# EAGLE design RHD2132_headstage_16 (EAGLE 6.2)
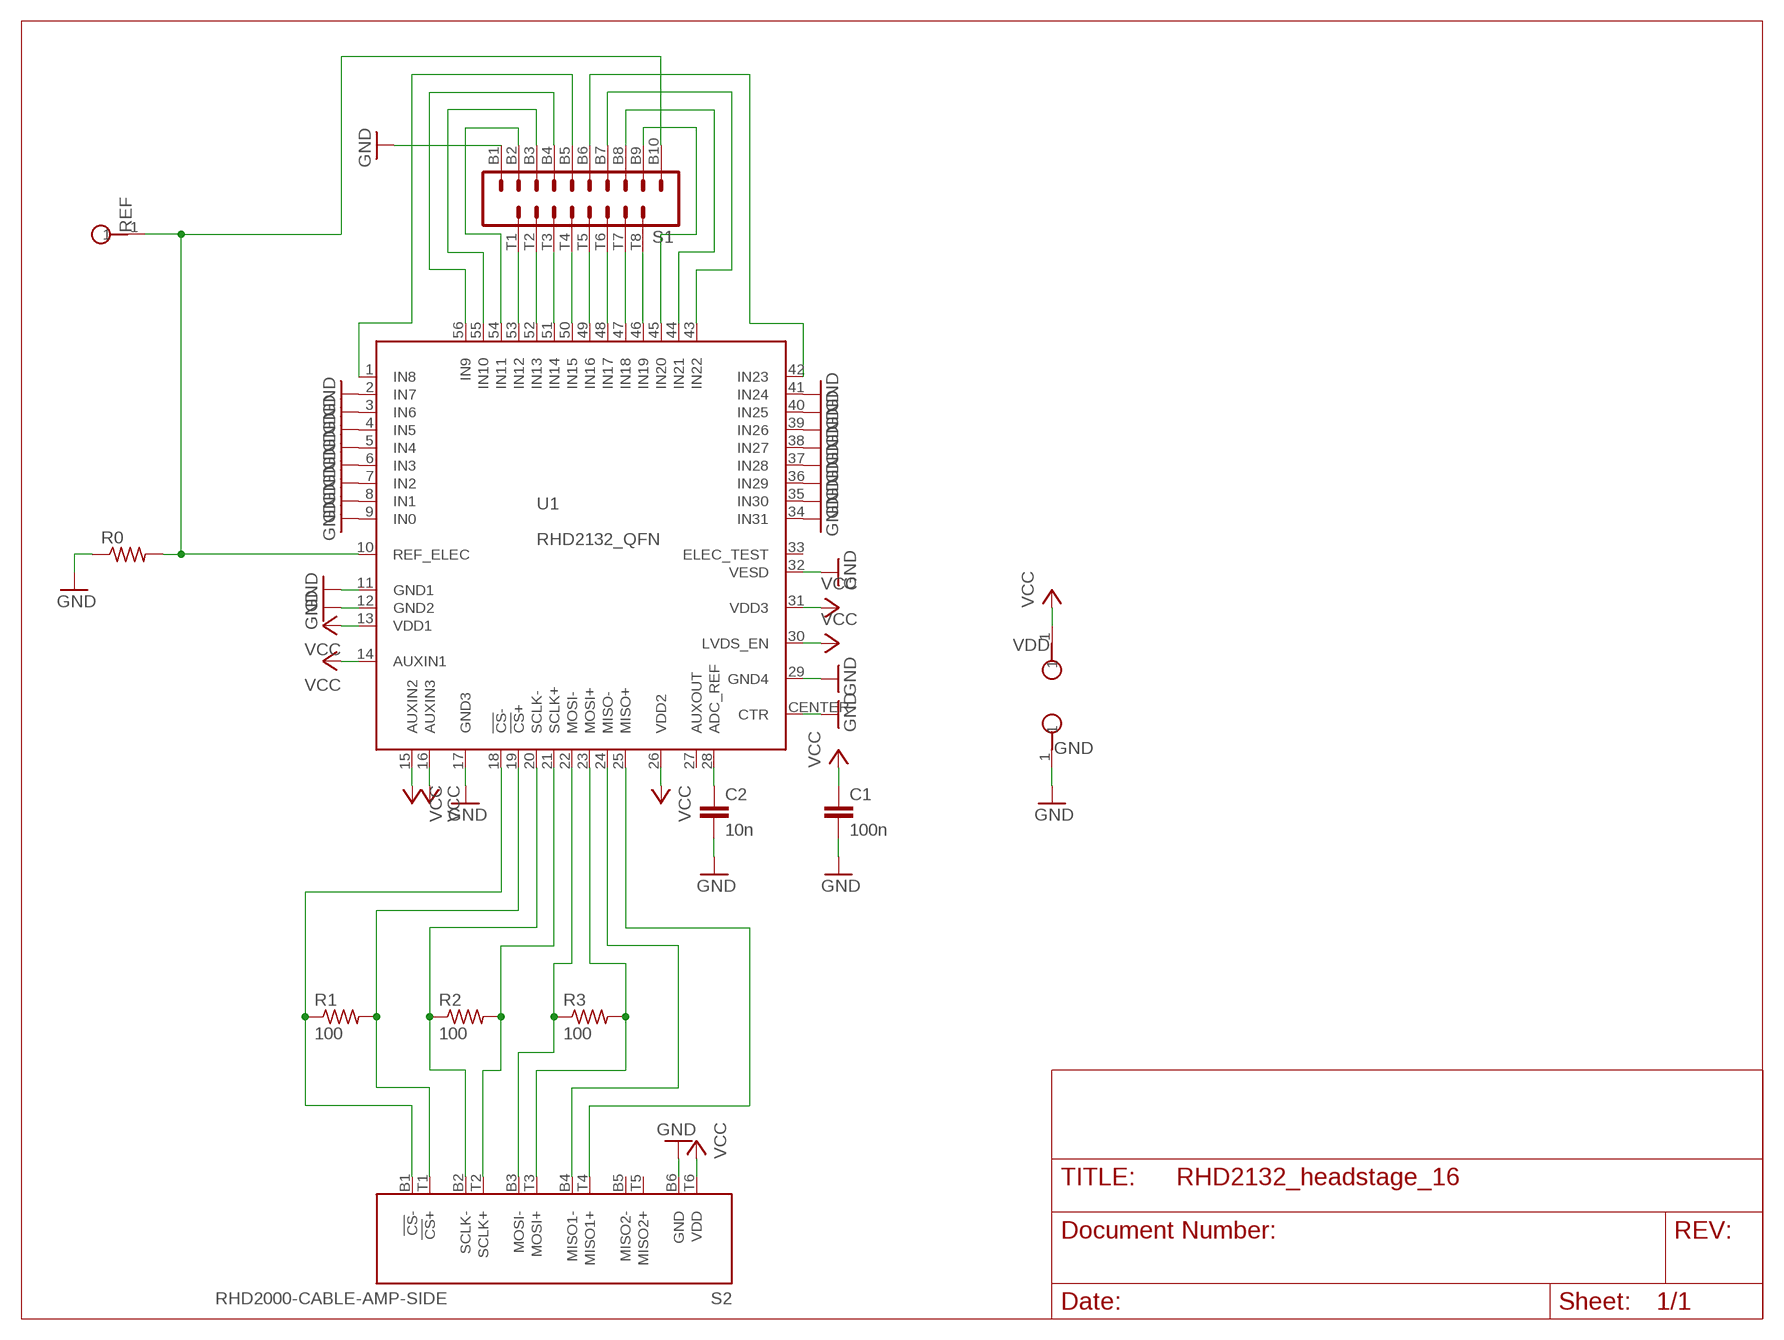
[diagram p0: schematic, sheet 1]

## Parts
C1  100n  C_0402  [0402]
C2  10n  C_0402  [0402]
GND  TESTPOINT_SMALL  [TESTPOINT_SMALL]
R0  R_0402  [0402]
R1  100  R_0402  [0402]
R2  100  R_0402  [0402]
R3  100  R_0402  [0402]
REF  TESTPOINT_SMALL  [TESTPOINT_SMALL]
S1  OMNETICS_A79041  [OMNETICS_A79041]
S2  RHD2000-CABLE-AMP-SIDE  [OMNETICS_PZN-12-AA]
U1  RHD2132_QFN  [QFN56_8_X_8_LARGE]
VDD  TESTPOINT_SMALL  [TESTPOINT_SMALL]

## Nets
GND: C1.2 C2.2 GND.1 R0.1 S1.B1 S2.B6(GND) U1.2(IN7) U1.3(IN6) U1.4(IN5) U1.5(IN4) U1.6(IN3) U1.7(IN2) U1.8(IN1) U1.9(IN0) U1.11(GND1) U1.12(GND2) U1.17(GND3) U1.29(GND4) U1.32(VESD) U1.34(IN31) U1.35(IN30) U1.36(IN29) U1.37(IN28) U1.38(IN27) U1.39(IN26) U1.40(IN25) U1.41(IN24) U1.CENTER(CTR)
N$1: R0.2 REF.1 S1.B10 U1.10(REF_ELEC)
N$3: S1.B6 U1.42(IN23)
N$11: R1.1 S2.B1(!CS!-) U1.18(!CS!-)
N$19: S1.T4 U1.50(IN15)
N$20: S1.T3 U1.51(IN14)
N$21: S1.T2 U1.52(IN13)
N$22: S1.B4 U1.56(IN9)
N$23: S1.B3 U1.55(IN10)
N$24: S1.B2 U1.54(IN11)
N$25: S1.T1 U1.53(IN12)
N$26: S1.T5 U1.49(IN16)
N$27: S1.T6 U1.48(IN17)
N$28: S1.T7 U1.47(IN18)
N$29: S1.T8 U1.46(IN19)
N$30: S1.B9 U1.45(IN20)
N$31: S1.B8 U1.44(IN21)
N$32: S1.B7 U1.43(IN22)
N$33: S1.B5 U1.1(IN8)
N$35: R1.2 S2.T1(!CS!+) U1.19(!CS!+)
N$36: R2.1 S2.B2(SCLK-) U1.20(SCLK-)
N$37: R2.2 S2.T2(SCLK+) U1.21(SCLK+)
N$38: R3.1 S2.B3(MOSI-) U1.22(MOSI-)
N$39: R3.2 S2.T3(MOSI+) U1.23(MOSI+)
N$40: S2.B4(MISO1-) U1.24(MISO-)
N$41: S2.T4(MISO1+) U1.25(MISO+)
N$42: C2.1 U1.28(ADC_REF)
VCC: C1.1 S2.T6(VDD) U1.13(VDD1) U1.14(AUXIN1) U1.15(AUXIN2) U1.16(AUXIN3) U1.26(VDD2) U1.30(LVDS_EN) U1.31(VDD3) VDD.1
Unconnected: S2.B5(MISO2-) S2.T5(MISO2+) U1.27(AUXOUT) U1.33(ELEC_TEST)

## Library data of the parts
C1 C2 = RHD2000_eval_board:C: Capacitor
GND REF VDD = RHD2000_eval_board:TESTPOINT: PCB Test Point
R0 R1-R3 = RHD2000_eval_board:R: Resistor
S1 = harrison:OMNETICS_A79041
S2 = RHD2000:RHD2000-CABLE-AMP-SIDE
U1 = RHD2000:RHD2132

## Net classes
1 thick: width 1.016 mm
2 power: width 0.61 mm

## Board
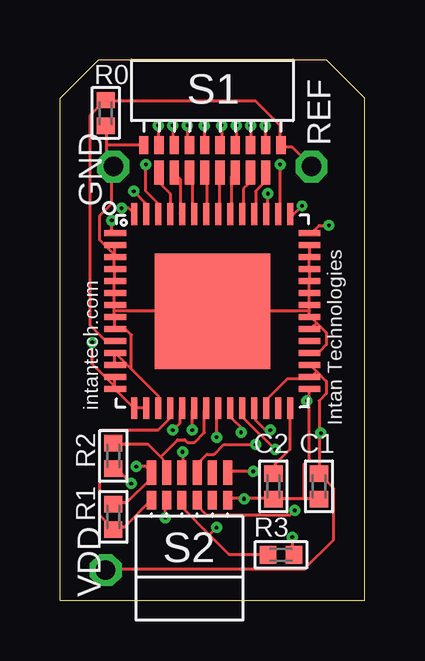
[diagram p1: board, top side]
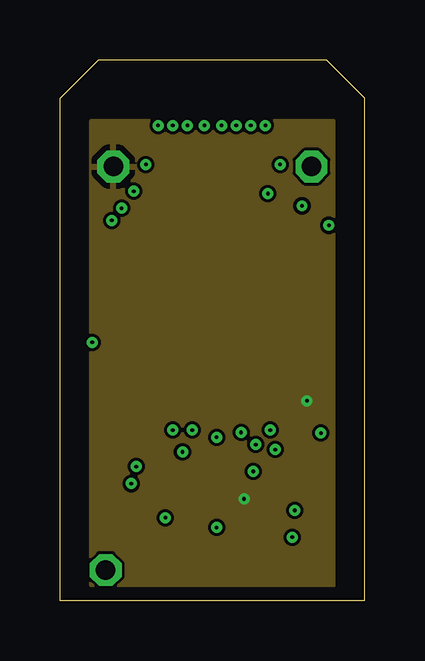
[diagram p2: board, inner layer Route2]
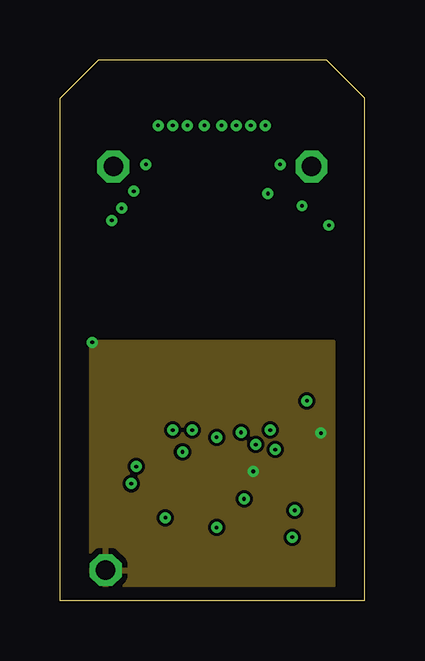
[diagram p3: board, inner layer Route3]
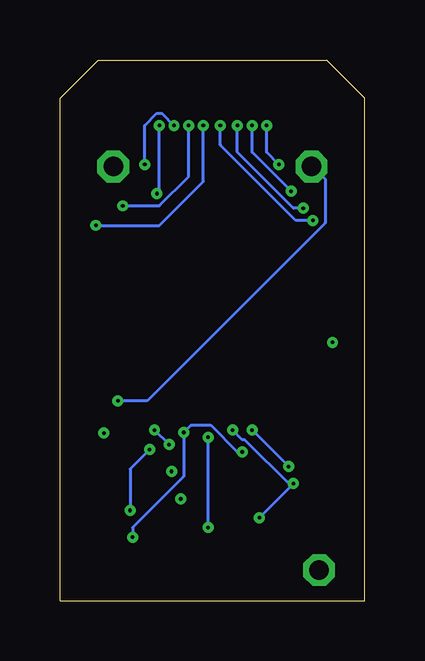
[diagram p4: board, bottom side, seen from below]

Size 12.7 x 22.54 mm. Coordinates in mm from the lower left corner, seen from the top.
Outline: 0,0 0,20.95 1.59,22.54 11.11,22.54 12.7,20.95 12.7,0 0,0
Copper layers (1*2+3*16): Top 0.035mm / dielectric 1.5mm / Route2 0.035mm / dielectric 0.15mm / Route3 0.035mm / dielectric 0.2mm / Bottom 0.035mm
Design rules: minimum track width 5mil, minimum drill 6mil, track to track 5mil, track to pad 5mil, pad to pad 5mil, via to via 5mil, smd to smd 5mil, copper to edge 15mil, drill to drill 15mil, minimum pad ring 10mil, minimum via ring 6mil, stop-mask expansion 4mil, vias tented up to drill 0mil, thermal gap 10mil

### Footprints (pad centres in the part's own frame; a part is rotated, then mirrored left to right if it is on the bottom)
0402 = smd 0.686 x 0.762: 1 -0.533,0; 2 0.533,0
TESTPOINT_SMALL = drill 0.813 octagon: 1 0,0
OMNETICS_A79041 = smd 0.381 x 0.762: B1 -2.857,-1.016; B2 -2.223,-1.016; B3 -1.587,-1.016; B4 -0.953,-1.016; B5 -0.318,-1.016; B6 0.318,-1.016; B7 0.953,-1.016; B8 1.587,-1.016; B9 2.223,-1.016; B10 2.857,-1.016 | smd 0.381 x 1.016: T1 -2.223,-2.159; T2 -1.587,-2.159; T3 -0.953,-2.159; T4 -0.318,-2.159; T5 0.318,-2.159; T6 0.953,-2.159; T7 1.587,-2.159; T8 2.223,-2.159
OMNETICS_PZN-12-AA = smd 0.381 x 0.762: B1 1.587,-1.016; B2 0.953,-1.016; B3 0.318,-1.016; B4 -0.318,-1.016; B5 -0.953,-1.016; B6 -1.587,-1.016 | smd 0.381 x 1.016: T1 1.587,-2.159; T2 0.953,-2.159; T3 0.318,-2.159; T4 -0.318,-2.159; T5 -0.953,-2.159; T6 -1.587,-2.159
QFN56_8_X_8_LARGE = smd 0.9 x 0.25: 1 -4.05,3.25; 2 -4.05,2.75; 3 -4.05,2.25; 4 -4.05,1.75; 5 -4.05,1.25; 6 -4.05,0.75; 7 -4.05,0.25; 8 -4.05,-0.25; 9 -4.05,-0.75; 10 -4.05,-1.25; 11 -4.05,-1.75; 12 -4.05,-2.25; 13 -4.05,-2.75; 14 -4.05,-3.25; 29 4.05,-3.25; 30 4.05,-2.75; 31 4.05,-2.25; 32 4.05,-1.75; 33 4.05,-1.25; 34 4.05,-0.75; 35 4.05,-0.25; 36 4.05,0.25; 37 4.05,0.75; 38 4.05,1.25; 39 4.05,1.75; 40 4.05,2.25; 41 4.05,2.75; 42 4.05,3.25 | smd 0.25 x 0.9: 15 -3.25,-4.05; 16 -2.75,-4.05; 17 -2.25,-4.05; 18 -1.75,-4.05; 19 -1.25,-4.05; 20 -0.75,-4.05; 21 -0.25,-4.05; 22 0.25,-4.05; 23 0.75,-4.05; 24 1.25,-4.05; 25 1.75,-4.05; 26 2.25,-4.05; 27 2.75,-4.05; 28 3.25,-4.05; 43 3.25,4.05; 44 2.75,4.05; 45 2.25,4.05; 46 1.75,4.05; 47 1.25,4.05; 48 0.75,4.05; 49 0.25,4.05; 50 -0.25,4.05; 51 -0.75,4.05; 52 -1.25,4.05; 53 -1.75,4.05; 54 -2.25,4.05; 55 -2.75,4.05; 56 -3.25,4.05 | smd 4.8 x 4.8: CENTER 0,0

### Placement (x,y rotation side)
C1  10.79,4.76 270 top
C2  8.89,4.76 270 top
GND  2.22,18.1 90 top
R0  1.91,20.33 90 top
R1  2.22,3.49 90 top
R2  2.22,6.03 90 top
R3  9.21,1.91 0 top
REF  10.48,18.1 270 top
S1  6.35,20 0 top
S2  5.4,3.17 180 top
U1  6.35,12.06 0 top
VDD  1.91,1.27 0 top

### Tracks (layer width: path | path; a pad name or v marks a point on that pad's centre or on a via)
GND  (via drill 0.15)
  Top 0.127: U1.41 10.39,14.73 10.39,14.33 U1.40 10.39,14.22 10.39,13.82 U1.39 10.39,13.72 10.39,13.41 U1.38 10.39,13.31 10.39,12.9 U1.37 10.39,12.8 10.39,12.39 U1.36 10.39,12.29 10.39,12.09 | 10.69,11.58 10.49,11.79 U1.35 10.39,11.89 10.39,12.09 | 10.69,11.58 11.1,11.18 11.1,10.67 10.79,10.36 10.49,10.36 U1.32 | 10.69,11.58 10.49,11.38 U1.34 | 10.39,12.09 6.43,12.09 U1.CENTER 6.33,12.09 2.26,12.09 | S2.B6 7.04,4.27 8.87,4.27 C2.2 8.97,4.27 10.19,4.27 | 10.19,4.27 10.79,4.27 C1.2 | 10.39,8.33 10.39,5.89 10.19,5.69 10.19,4.27 | 10.39,8.33 10.39,8.74 U1.29 | 1.96,19 1.96,18.39 2.16,18.19 GND.1 2.16,18.09 2.16,16.56 1.65,16.05 1.65,15.04 2.26,14.43 | 1.96,19 1.96,19.71 R0.1 | 1.96,19 S1.B1 | 2.26,14.43 2.26,14.73 U1.2 | 2.26,14.43 2.26,14.33 U1.3 | 2.26,12.09 2.26,11.89 U1.8 2.26,11.79 2.26,11.38 U1.9 2.36,11.28 2.77,11.28 2.97,11.07 2.97,9.65 | 2.26,12.09 2.26,12.29 U1.7 2.26,12.39 2.26,12.8 U1.6 2.26,12.9 2.26,13.31 U1.5 2.26,13.41 2.26,13.72 U1.4 2.26,13.82 2.26,14.22 U1.3 | U1.12 2.26,9.86 2.26,10.26 U1.11 2.36,10.26 2.97,9.65 | 2.97,9.65 4.09,8.53 U1.17 | 2.26,14.43 U1.3 | v10.29,8.33 10.39,8.33
  Bottom 0.127: v10.29,8.33 9.07,8.33 1.65,15.75 1.65,17.58 2.16,18.09 GND.1
  other vias: 7.67,4.24
  pour Route2: 1.27,0.64 11.43,0.64 11.43,20 1.27,20
N$1
  Top 0.127: REF.1 9.68,18.9 9.27,18.9 S1.B10 9.17,19 9.17,19.81 8.15,20.83 1.96,20.83 R0.2 1.85,20.83 1.25,20.22 1.25,11.48 1.85,10.87 2.26,10.87 U1.10
N$3  (via drill 0.15)
  Top 0.127: v6.73,19.81 6.73,19 S1.B6 | v11.2,15.65 10.79,15.65 10.49,15.34 U1.42
  Bottom 0.127: v6.73,19.81 6.73,17.48 8.56,15.65 v11.2,15.65
N$11
  Top 0.127: S2.B1 2.67,3.05 2.26,3.05 R1.1 2.16,3.05 1.65,3.56 1.65,7.01 1.75,7.11 4.09,7.11 4.6,7.62 4.6,7.92 U1.18
N$19
  Top 0.127: U1.50 6.12,16.15 6.12,17.78 S1.T4
N$20
  Top 0.127: U1.51 5.51,16.15 5.51,17.68 5.41,17.78 S1.T3
N$21
  Top 0.127: U1.52 5,16.15 5,17.58 4.8,17.78 S1.T2
N$22  (via drill 0.15)
  Top 0.127: v5.31,19.81 5.31,19 S1.B4 | v2.56,16.36 2.87,16.36 3.07,16.15 U1.56
  Bottom 0.127: v5.31,19.81 5.31,18.69 2.97,16.36 v2.56,16.36
N$23  (via drill 0.15)
  Top 0.127: v4.7,19.81 4.7,19 S1.B3 | v3.07,17.07 3.58,16.56 3.58,16.15 U1.55
  Bottom 0.127: v4.7,19.81 4.7,18.69 v3.07,17.07
N$24  (via drill 0.15)
  Top 0.127: v4.09,19.81 4.09,19 S1.B2 | v3.58,18.19 3.58,17.07 4.09,16.56 4.09,16.15 U1.54
  Bottom 0.127: v4.09,19.81 4.09,18.69 v3.58,18.19
N$25
  Top 0.127: U1.53 4.6,16.15 4.6,16.97 4.19,17.37 4.19,17.78 S1.T1
N$26
  Top 0.127: U1.49 6.63,16.15 6.63,17.78 S1.T5
N$27
  Top 0.127: S1.T6 7.14,17.68 7.14,16.15 U1.48
N$28
  Top 0.127: U1.47 7.64,16.15 7.64,17.17 7.85,17.37 7.85,17.78 S1.T7
N$29
  Top 0.127: U1.46 8.15,16.15 8.15,17.07 8.56,17.48 8.56,17.78 S1.T8
N$30  (via drill 0.15)
  Top 0.127: v8.56,19.81 S1.B9 | v8.66,16.97 8.66,16.15 U1.45
  Bottom 0.127: v8.56,19.81 8.56,17.07 v8.66,16.97
N$31  (via drill 0.15)
  Top 0.127: v7.95,19.81 S1.B8 | v9.17,18.19 9.17,16.15 U1.44
  Bottom 0.127: v7.95,19.81 8.46,20.32 8.66,20.32 9.17,19.81 v9.17,18.19
N$32  (via drill 0.15)
  Top 0.127: v7.34,19.81 7.34,19 S1.B7 | v10.08,16.46 9.68,16.05 U1.43
  Bottom 0.127: v7.34,19.81 7.34,17.68 8.56,16.46 v10.08,16.46
N$33  (via drill 0.15)
  Top 0.127: v6.02,19.81 S1.B5 | v2.16,15.85 2.16,15.44 2.26,15.34 U1.1
  Bottom 0.127: v6.02,19.81 S1.B5 2.87,15.85 v2.16,15.85
N$35  (via drill 0.15)
  Top 0.127: R1.2 2.26,4.06 2.77,4.06 3.79,5.08 3.79,5.28 S2.T1 3.79,5.38 3.58,5.59 v3.17,5.59 | v4.7,7.11 5,7.42 5,7.92 U1.19
  Bottom 0.127: v3.17,5.59 v4.7,7.11
N$36  (via drill 0.15)
  Top 0.127: v4.39,3.45 4.39,4.17 S2.B2 | v2.97,4.88 2.26,5.59 R2.1 | v5.51,7.11 5.51,7.92 U1.20
  Bottom 0.127: 3.07,4.78 v4.39,3.45 | v5.51,7.11 5.11,6.71 5,6.71 3.07,4.78 | 3.07,4.78 v2.97,4.88
N$37
  Top 0.127: 4.19,5.99 4.39,5.79 4.39,5.38 S2.T2 | 4.19,5.99 3.68,6.5 2.26,6.5 R2.2 | 4.19,5.99 4.9,6.71 5.21,6.71 5.31,6.6 5.61,6.6 6.02,7.01 6.02,7.92 U1.21
N$38  (via drill 0.15)
  Top 0.127: 6.22,2.74 5.11,3.86 5.11,4.17 S2.B3 | 6.22,2.74 7.04,1.93 8.66,1.93 R3.1 | v6.53,6.81 6.53,7.92 U1.22 | 6.22,2.74 v6.53,3.05
  Bottom 0.127: v6.53,3.05 v6.53,6.81
N$39  (via drill 0.15)
  Top 0.127: v9.68,2.64 9.68,1.93 R3.2 | v7.54,7.01 7.54,7.21 7.14,7.62 7.14,7.92 U1.23 | v5.11,6.2 5.11,5.38 S2.T3
  Bottom 0.127: v9.68,2.64 9.68,3.05 7.54,5.18 v7.54,7.01 7.24,7.32 6.43,7.32 5.31,6.2 v5.11,6.2
N$40  (via drill 0.15)
  Top 0.127: S2.B4 5.71,3.96 6.12,3.56 9.58,3.56 v9.78,3.76 | v8.97,6.3 7.64,7.62 7.64,7.92 U1.24
  Bottom 0.127: v9.78,3.76 9.78,5.49 v8.97,6.3
N$41  (via drill 0.15)
  Top 0.127: v8.76,7.11 8.56,7.11 8.15,7.52 8.15,7.92 U1.25 | v8.15,6.5 6.83,6.5 6.43,6.1 6.12,6.1 5.71,5.69 S2.T4
  Bottom 0.127: v8.15,6.5 v8.76,7.11
N$42
  Top 0.127: C2.1 8.97,5.38 8.97,5.69 9.58,6.3 9.58,7.92 U1.28
VCC  (via drill 0.15)
  Top 0.127: U1.26 8.66,8.03 8.66,8.43 9.47,9.25 10.39,9.25 U1.30 10.49,9.35 10.69,9.55 | 10.69,9.55 10.49,9.75 U1.31 | 10.69,9.55 11.1,9.14 11.1,8.64 10.79,8.33 C1.1 10.79,5.28 11.4,4.67 11.4,2.54 10.19,1.32 1.96,1.32 VDD.1 | v8.05,5.38 7.04,5.38 S2.T6 | 2.26,8.94 2.26,9.25 U1.13 | 2.26,8.94 2.26,8.84 U1.14 2.36,8.74 3.07,8.03 U1.15 3.17,8.03 3.58,8.03 U1.16 | v1.35,10.77 1.35,9.86 2.26,8.94
  other vias: 10.87,6.99
  pour Route3: 1.27,0.64 11.43,0.64 11.43,10.79 1.27,10.79

### Text on the board
tPlace: intantech.com | Intan Technologies